# Altium schematic sheet Sheet2.SchDoc
size A4; SheetNumber: 2; SheetTotal: 2
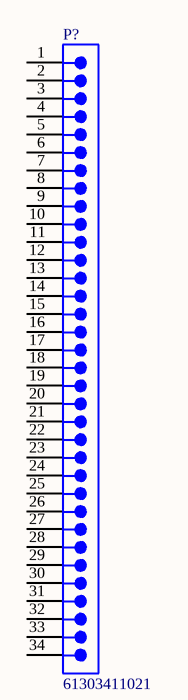
[diagram p0: Sheet2.SchDoc]

## Parts
P?  61303411021  [61303411021]

## Nets

Not connected (* = marked no-connect by the designer): P? 1 2 3 4 5 6 7 8 9 10 11 12 13 14 15 16 17 18 19 20 21 22 23 24 25 26 27 28 29 30 31 32 33 34

## Library data of the parts
P? = CMP-1502-01125-4: THT Angled Pin Header WR-PHD, Pitch 2.54 mm, Single Row, 34 pins; Connector Type: Male Pin; Number of Contacts: 34; Current Rating: 3A; Pitch: 2.54mm; Contact Resistance: 20mΩ; Operating Supply Voltage: 250V; Gender: Male; Packaging: Bulk; RoHS: Compliant; Termination: Solder; Contact Plating: Gold; Number of Rows: 1; Contact Material: Copper; Number of Pins: 34; Number of Positions: 34; Lead Pitch: 2.54mm; Color: Black; Contact Mating Length: 5.9944mm; Mount: Through Hole